# Altium schematic sheet Salida.SchDoc
size A3; SheetNumber: 5; SheetTotal: 6
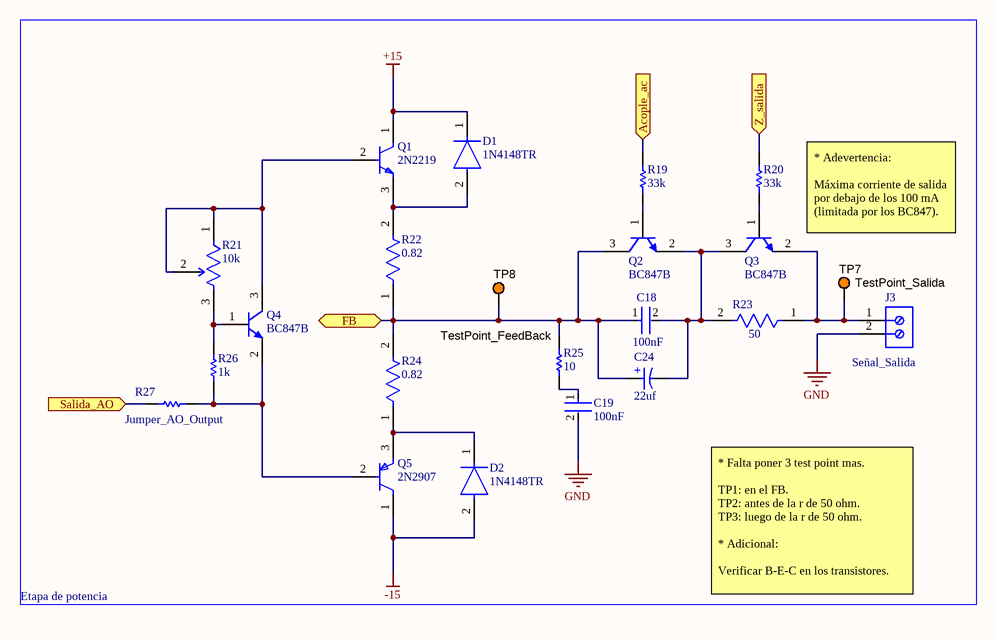
[diagram p0: Salida.SchDoc]

## Parts
C18  100nF  [FP-0805-L_2_01_0_2-W_1_25-IPC_B]
C19  100nF  [FP-0805-L_2_01_0_2-W_1_25-IPC_B]
C24  22uf  [WCAP-ASLU_D4H5.5]
D1  1N4148TR  [FP-6_560-5004_12-4-MFG]
D2  1N4148TR  [FP-6_560-5004_12-4-MFG]
J3  Señal_Salida  [691102710002]
Q1  2N2219  [FP-135AR-MFG]
Q2  BC847B  [INF-SOT23_L]
Q3  BC847B  [INF-SOT23_L]
Q4  BC847B  [INF-SOT23_L]
Q5  2N2907  [FP-135AR-MFG]
R19  33k  [RESC2013X60X35ML10T20]
R20  33k  [RESC2013X60X35ML10T20]
R21  10k  [FP-3296W-MFG]
R22  0.82  [FP-RLR07-MFG]
R23  50  [FP-RLR07-MFG]
R24  0.82  [FP-RLR07-MFG]
R25  10  [RESC2013X60X35ML10T20]
R26  1k  [RESC2013X60X35ML10T20]
R27  Jumper_AO_Output  [RESC2013X50X30LL20T20]
TP7  TestPoint_Salida  [KSTN-5003]
TP8  TestPoint_FeedBack  [KSTN-5003]

## Blocks framed on the sheet
Etapa de potencia: C18 C19 C24 D1 D2 J3 Q1-Q5 R19-R27 TP7 TP8

## Ports
Acople_ac (in), FB (bidir), Salida_AO (in), Z_salida (in)

## Nets
+15: D1.1(C) Q1.1(C)
-15: D2.2(A) Q5.1(C)
GND: C19.2 J3.2
Acople_ac: R19.2 ; port Acople_ac
FB: C18.1 C24.1(P) Q2.3(C) R22.1 R24.2 R25.2 TP8.1 ; port FB
Salida_AO: R27.1 ; port Salida_AO
Z_salida: R20.2 ; port Z_salida
NetC18_2: C18.2 C24.2(N) Q2.2(E) Q3.3(C) R23.2
NetC19_1: C19.1 R25.1
NetD1_2: D1.2(A) Q1.3(E) R22.2
NetD2_1: D2.1(C) Q5.3(E) R24.1
NetJ3_1: J3.1 Q3.2(E) R23.1 TP7.1
NetQ1_2: Q1.2(B) Q4.3(C) R21.1(CCW) R21.2(WIPER)
NetQ2_1: Q2.1(B) R19.1
NetQ3_1: Q3.1(B) R20.1
NetQ4_1: Q4.1(B) R21.3(CW) R26.2
NetQ4_2: Q4.2(E) Q5.2(B) R26.1 R27.2

## Notes on the sheet
- * Adevertencia:
  Máxima corriente de salida por debajo de los 100 mA (limitada por los BC847).
- * Falta poner 3 test point mas.
  TP1: en el FB.
  TP2: antes de la r de 50 ohm.
  TP3: luego de la r de 50 ohm.
  * Adicional:
  Verificar B-E-C en los transistores.
- (in symbol CMP-03913-53914652-1) +

## Library data of the parts
C18 C19 = CMP-2007-04174-2: General Purpose Ceramic Capacitor, 0805, 100nF, 10%, X7R, 15%, 100V; Packaging: Tape and Reel; Min Operating Temperature: -55°C; Dielectric Material: Ceramic; Height: 1.4mm; Voltage Rating: 100V; Termination: SMD/SMT; Case Code (Imperial): 0805; Case Code (Metric): 2012; Case/Package: 0805; Construction: Flat; Radiation Hardening: No; Series: -; Dielectric: X7R; Package Quantity: 2000; Mount: Surface Mount; Capacitance: 100nF; Contact Plating: Tin; Voltage: 100V; Lead Free: Lead Free; Depth: 1.25mm; RoHS Compliant: Yes; Number of Pins: 2; Max Operating Temperature: 125°C; Length: 2.01mm; Voltage Rating (DC): 100V; Thickness: 0.055inch; REACH SVHC: No SVHC; Width: 0.049inch; Tolerance: 10%
C24 = CMP-03913-53914652-1: 865090640004 WCAP-ASLU Aluminum Electrolytic Capacitors; Capacitance: 470nF; Tolerance: 20%; Voltage Rating: 50V; Material: Aluminium; Life (Hours): 1000hours; Ripple Current: 4mA; Insulation Resistance: 16.6667MΩ; Leakage Current: 400nA; Polarity: Polar; Packaging: Tape & Reel (TR); Max Operating Temperature: 85°C; Min Operating Temperature: -40°C; Height - Seated (Max): 5.5118mm; Diameter: 4mm; Length: 5.5mm; Ripple Current (AC): 4mA; Width: 4.3mm; RoHS: Compliant; Case/Package: Radial; Mount: Surface Mount; REACH SVHC: Unknown; Height: 5.5mm; Voltage Rating (DC): 50V; NexarPartId: 53914652
D1 D2 = CMP-02540-000029-2: DIODE GEN PURP 75V 300MA DO35; Element Configuration: Single; Power Dissipation: 440mW; Reverse Recovery Time: 8ns; Peak Non-Repetitive Surge Current: 2A; Max Repetitive Reverse Voltage (Vrrm): 100V; Forward Voltage: 1V; Current Rating: 150A; Number of Pins: 2; Packaging: Tape and Reel; Mount: Through Hole; Forward Current: 300mA; Lead Free: Lead Free; Max Operating Temperature: 175°C; Min Operating Temperature: -65°C
J3 = CMP-1502-03258-2: NexarPartId: 8917706; Number of Levels: 1; Number of Positions Per Level: 2; Current: 15A; Voltage: 300V; Pitch: 5.0038mm; Plating: Steel; Stripping Length: -6mm; Wire Gauge (Min): 14AWG; Wire Gauge (Max): 22AWG; Length: 7.5mm; Contact Material: Brass; Contact Plating: Tin; Packaging: Box; Number of Pins: 2; Voltage Rating: 300V; Termination: Screw; Number of Contacts: 2; Color: Blue; Current Rating: 15A; Mount: Through Hole; Max Operating Temperature: 105°C; Min Operating Temperature: -40°C; REACH SVHC: Unknown; Height: 13.4mm; Width: 11.2mm; Housing Material: Nylon; RoHS: Compliant; Wire/Cable Gauge: 22AWG; Lead Pitch: 5mm
Q1 = CMP-00278-84324566-1: BC548CTA Small Signal Bipolar Transistor, 0.1A I(C), 30V V(BR)CEO, 1-Element, NPN, Silicon, TO-92; Manufacturer Lifecycle Status: ACTIVE; Max Power Dissipation: 500mW; Max Collector Current: 100mA; Max Junction Temperature (Tj): 150°C; Transition Frequency: 300MHz; Emitter Base Voltage (VEBO): 5V; hFE Min: 110; Element Configuration: Single; Collector Emitter Saturation Voltage: 250mV; Number of Elements: 1; Height: 4.58mm; Width: 3.86mm; Collector Emitter Voltage (VCEO): 30V; Schedule B: 8541210080, 8541210080; Max Operating Temperature: 150°C; REACH SVHC: No SVHC; Number of Pins: 3; Power Dissipation: 500mW; Frequency: 300MHz; Polarity: NPN; Lead Free: Lead Free; Voltage Rating (DC): 30V; Weight: 240mg; Max Breakdown Voltage: 30V; Current Rating: 100mA; NexarPartId: 84324566; Min Operating Temperature: -65°C; Collector Emitter Breakdown Voltage: 30V; Gain Bandwidth Product: 300MHz; Radiation Hardening: No; Collector Base Voltage (VCBO): 30V; RoHS: Compliant; Contact Plating: Tin; Length: 4.58mm; Lifecycle Status: Production; Case/Package: TO-92; Mount: Through Hole; Max Frequency: 300MHz
Q2-Q4 = CMP-1177-00042-1: NPN Silicon AF Transistor, 45 V VCEO, 100 mA IC, SOT23, Reel, Green; Manufacturer: Infineon; VEBO (max): 6Â V; ICBO (max): 15Â nA; VCBO (max): 50Â V; IBM (max): 200Â mA; Green: TRUE; Ptot (max): 330Â mW; fT (typ): 250Â MHz; IC (max): 100Â mA; VCEO (max): 45Â V; PackageDescription: 3-Pin Small Outline Transistor Package, 1.3 x 2.9 mm Body, 0.95 mm Pitch; ComponentLink3URL: http://www.infineon.com/dgdl/SOT23-Package_Overview.pdf?folderId=db3a30431936bc4b0119532290053c66&fileId=db3a30431936bc4b0119533468123c85; PackageVersion: Apr-08; Packing: Reel; ComponentLink3Description: Package Specification; ComponentLink2URL: http://www.infineon.com/dgdl/bc847series_bc848series_bc849series_bc850series.pdf?folderId=db3a304314dca389011541d30fa21656&fileId=db3a304314dca389011541d4630a1657; ComponentLink1URL: http://www.infineon.com/; ComponentLink2Description: Datasheet; Polarity: NPN; Mounting Technology: Surface Mount; PackageReference: SOT23; ICM (max): 200Â mA; ComponentLink1Description: Manufacturer URL; PartNumber: BC847B
Q5 = CMP-00278-84408945-1: BC557BTF Small Signal Bipolar Transistor, 0.1A I(C), 45V V(BR)CEO, 1-Element, PNP, Silicon, TO-92; Manufacturer Lifecycle Status: ACTIVE; Max Power Dissipation: 500mW; Frequency: 150MHz; hFE Min: 110; Number of Elements: 1; Current Rating: -100mA; Collector Emitter Saturation Voltage: -250mV; Max Collector Current: 100mA; Emitter Base Voltage (VEBO): -5V; Voltage Rating (DC): -45V; Element Configuration: Single; Max Frequency: 10MHz; Collector Base Voltage (VCBO): -50V; Collector Emitter Voltage (VCEO): 45V; Contact Plating: Tin; Min Operating Temperature: -65°C; RoHS: Compliant; Max Operating Temperature: 150°C; Weight: 240mg; Power Dissipation: 500mW; Lifecycle Status: Production; Case/Package: TO-92; Collector Emitter Breakdown Voltage: 45V; Length: 5.2mm; Schedule B: 8541210080, 8541210080; Lead Free: Lead Free; Polarity: PNP; REACH SVHC: No SVHC; Mount: Through Hole; NexarPartId: 84408945; Max Breakdown Voltage: 45V; Transition Frequency: 150MHz; Height: 5.33mm; Number of Pins: 3; Gain Bandwidth Product: 150MHz; Width: 4.19mm
R19 R20 R25 R26 = CMP-2100-03671-1: Chip Resistor, 1 KOhm, +/- 1%, 125 mW, -55 to 155 degC, 0805 (2012 Metric), RoHS, Tape and Reel; Manufacturer: Yageo; Temperature Coefficient: 100ppm/degreesC; Voltage Rating (DC): 150V; Max Power Dissipation: 125mW; Resistance: 1KOhm; Number of Pins: 2; Number of Terminations: 2; Datasheet URL: http://www.yageo.com/NewPortal/yageodocoutput?fileName=/pdf/R-Chip/PYu-RC_Group_51_RoHS_L_5.pdf; Length: 0.079inch; Package Description: 2-Pin Surface Mounted Device, Body 2 x 1.25 mm; Depth: 1.25mm; Height: 0.024inch; Military Standard: Not; Case/Package: 0805; Package Reference: 0805; RoHSCompliant: true; Lead Free: LeadFree; Packaging: TapeandReel; Package Quantity: 1; Datasheet Version: Rev. 5, 10/2016; Tolerance: 1%; Min Operating Temperature: -55degC; Voltage Rating: 150V; Composition: ThickFilm; Case Code (Imperial): 0805; Power Rating: 125mW; Width: 0.049inch; Case Code (Metric): 2012; Manufacturer URL: http://www.yageo.com/; Max Operating Temperature: 155degC; REACH SVHC: Unknown; Termination: SMD/SMT
R21 = CMP-07234-000046-1: TRIMMER 500 OHM 0.5W PC PIN TOP; Resistance: 500R; Temperature Coefficient: 100ppm/°C; Resistance Tolerance: 10%; Number of Turns: 25; Max Power Dissipation: 500mW; Packaging: Rail/Tube; Color: Blue; Technology: CERMET; Max Operating Temperature: 125°C; RoHS Compliant: Yes; Radiation Hardening: No; Series: 3296; Military Standard: Not; Width: 9.53mm; Weight: 0.03oz; Length: 9.53mm; Package Quantity: 50; Height: 0.395inch; Min Operating Temperature: -55°C; Lead Free: Lead Free; Mount: Through Hole; Depth: 4.83mm; Termination: Pin; Taper: Linear; Contact Plating: Tin; Resistor Type: Cermet; Tolerance: 10%; REACH SVHC: No SVHC; Power Rating: 500mW
R22-R24 = CMP-00030-39447724-1: RLR07C1001FSB14 Fixed Resistor, Metal Film, 0.25W, 1000ohm, 250V, 1% +/-Tol, 100ppm/Cel, Through Hole Mount; Wire/Cable Diameter: 50.8µm; Lead Diameter: 640µm; Max Power Dissipation: 250mW; Temperature Coefficient: 100ppm/°C; Resistance: 1kΩ; Lead Length: 38.1mm; Voltage Rating: 250V; Lead Free: Contains Lead; REACH SVHC: Unknown; Packaging: Bulk; Military Standard: MIL-PRF-39017; Width: 2.29mm; Max Operating Temperature: 150°C; Length: 7.62mm; Min Operating Temperature: -65°C; Composition: Metal Film; Diameter: 2.29mm; Radiation Hardening: No; Features: Military, Moisture Resistant, Weldable; Failure Rate: 0.001%; Case/Package: Conformal; Tolerance: 1%; Voltage Rating (DC): 250V; Schedule B: 8533210090, 8533210090; RoHS: Non-Compliant; Termination: Axial; Power Rating: 250mW; Contact Plating: Lead, Tin; NexarPartId: 39447724; Number of Terminations: 2; Number of Pins: 14
R27 = CMP-2001-04896-1: Manufacturer: Vishay Dale; Part Number: CRCW08050000Z0EA
TP7 TP8 = CMP-1672-00009-1: Test Point, Orange, 1-Pin THD, RoHS; Peak Reverse Current: 600 uA; Forward Current: 3 A; Max Surge Current: 80 A; Forward Voltage: 1.08 V; Max Operating Temperature: 150 degC; PackageReference: 5003; Pins: 2; ComponentLink2URL: http://keyelco.com/userAssets/file/M65p56.pdf; PackageDescription: 1-Pin Through Hole Device, Dia 2.54 mm; Weight: 0.01 lb; Diameter: 5.3 mm; Mount: Through Hole; Package Quantity: 500; Packaging: Bulk; Min Operating Temperature: -65 degC; ComponentLink1Description: Manufacturer URL; Height: 0.25 inch; ComponentLink1URL: http://www.keyelco.com/; ComponentLink2Description: Datasheet; Width: 0.25 inch; REACH SVHC: No SVHC; RoHSCompliant: true; Radiation Hardening: No; Length: 9.5 mm; DatasheetVersion: Jun-15